# EAGLE design DMX_isolated (EAGLE 6.4)
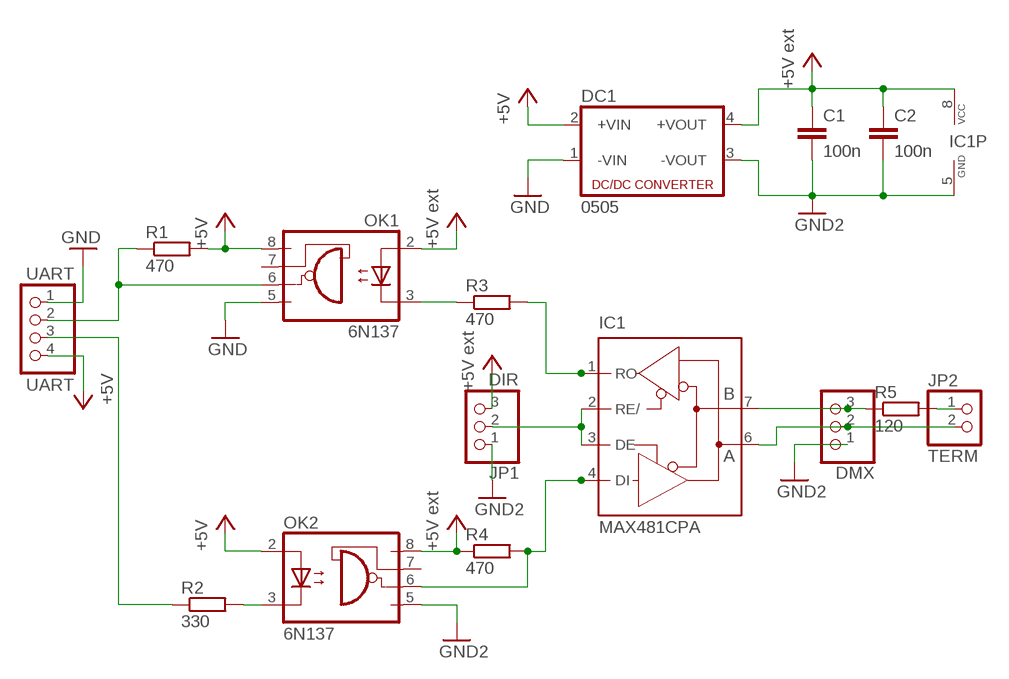
[diagram p0: schematic, sheet 1]

## Parts
C1  100n  C-EU050-024X044  [C050-024X044]
C2  100n  C-EU050-024X044  [C050-024X044]
DC1  0505  NME  [NME]
DMX  PINHD-1X3  [1X03]
IC1  MAX481CPA  [DIL08]
JP1  DIR  PINHD-1X3  [1X03]
JP2  TERM  PINHD-1X2  [1X02]
OK1  6N137  [DIL08]
OK2  6N137  [DIL08]
R1  470  R-EU_0204/5  [0204/5]
R2  330  R-EU_0204/5  [0204/5]
R3  470  R-EU_0204/5  [0204/5]
R4  470  R-EU_0204/2V  [0204V]
R5  120  R-EU_0204/2V  [0204V]
UART  UART  PINHD-1X4  [1X04]

## Nets
+5V: DC1.2(+VIN) OK1.8(VCC) OK2.2(A) R1.2 UART.4
+5V_EXT: C1.1 C2.1 DC1.4(+VOUT) IC1.8(VCC) JP1.3 OK1.2(A) OK2.8(VCC) R4.1 ; supply symbol labelled +5V ext
D2: R2.1 UART.3
GND: DC1.1(-VIN) OK1.5(GND) UART.1
GND_EXT: C1.2 C2.2 DC1.3(-VOUT) DMX.1 IC1.5(GND) JP1.1 OK2.5(GND) ; supply symbol labelled GND2
N$1: JP2.1 R5.2
N$2: DMX.3 IC1.7(B) R5.1
N$5: OK2.3(C) R2.2
N$6: IC1.2(RE/) IC1.3(DE) JP1.2
N$7: IC1.4(DI) OK2.6(VO) R4.2
N$8: OK1.3(C) R3.1
N$9: IC1.1(RO) R3.2
N$10: OK1.6(VO) R1.1 UART.2
N$17: DMX.2 IC1.6(A) JP2.2
Unconnected: OK1.7(VE) OK2.7(VE)

## Library data of the parts
C1 C2 = rcl:C-EU: CAPACITOR, European symbol
DC1 = dc-dc-converter:NME: DC-DC CONVERTER; MF: C & D TECHNOLOGIES, INC; MPN: NME1205D; OC_FARNELL: 1021466; OC_NEWARK: 98B8198
DMX = pinhead:PINHD-1X3: PIN HEADER
IC1 = maxim:MAX481CPA: RS485 TRANSEIVER; MPN: MAX481CPA+; OC_FARNELL: unknown; OC_NEWARK: 99K3445
JP1 = adafruit:PINHD-1X3: PIN HEADER
JP2 = pinhead:PINHD-1X2: PIN HEADER
OK1 OK2 = optocoupler:6N137: MOTOROLA OPTO COUPLER; MPN: 6N137; OC_FARNELL: 1328376; OC_NEWARK: 52M1895
R1-R5 = resistor:R-EU_: RESISTOR, European symbol
UART = pinhead:PINHD-1X4: PIN HEADER

## Net classes
1 power: width 0.508 mm

## Board
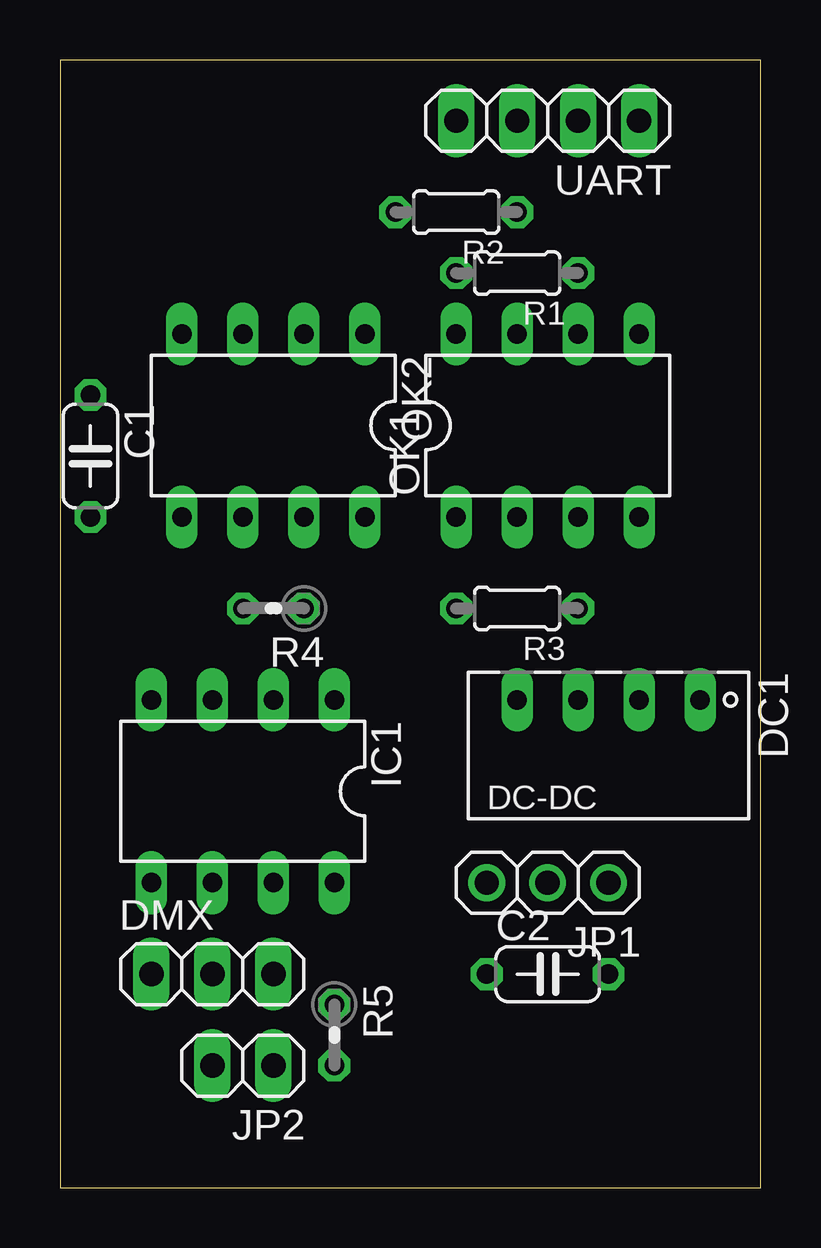
[diagram p1: board, top side]
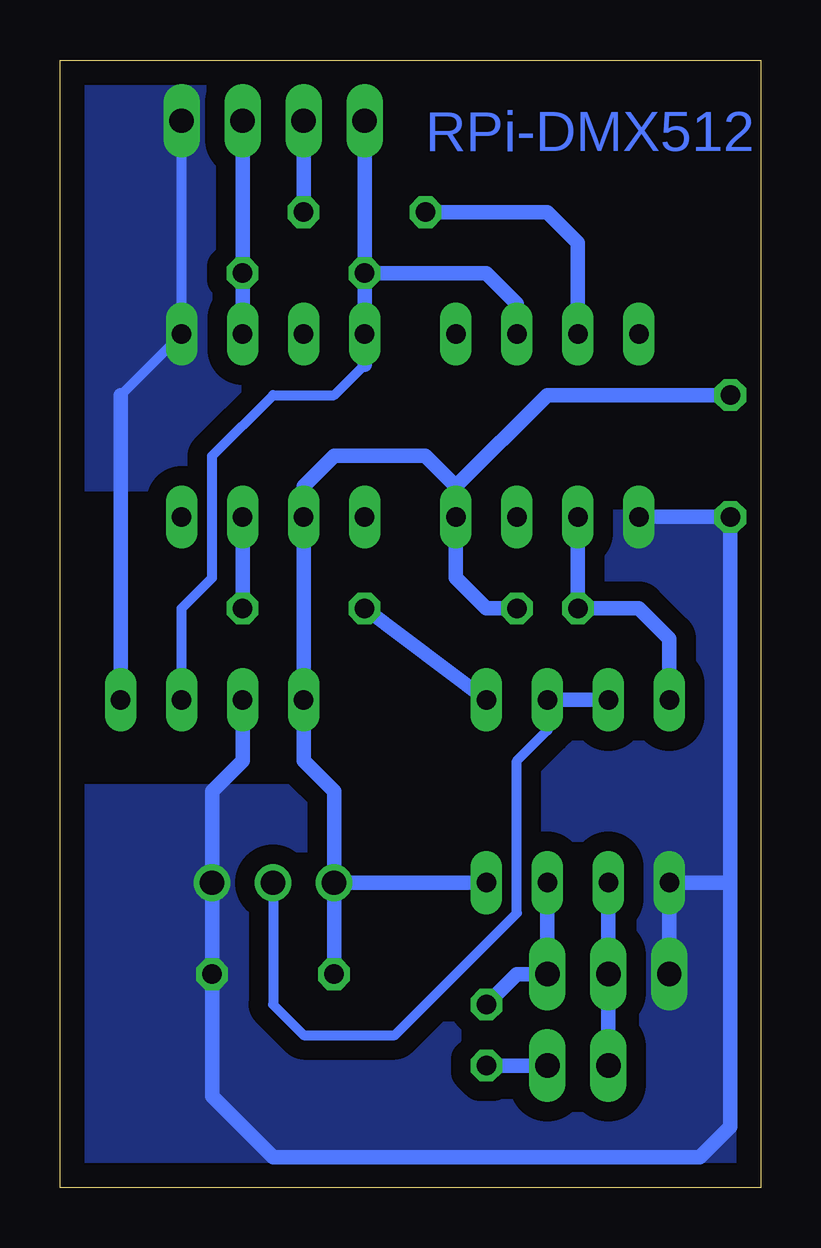
[diagram p2: board, bottom side, seen from below]

Size 29.2 x 46.98 mm. Coordinates in mm from the lower left corner, seen from the top.
Outline: 0,0 29.2,0 29.2,46.98 0,46.98 0,0
Copper layers (1*16): Top 0.035mm / dielectric 1.5mm / Bottom 0.035mm
Design rules "default": minimum track width 10mil, minimum drill 24mil, track to track 8mil, track to pad 8mil, pad to pad 8mil, via to via 8mil, smd to smd 8mil, copper to edge 40mil, drill to drill 8mil, minimum pad ring 10mil, minimum via ring 8mil, stop-mask expansion 4mil, vias tented up to drill 0mil, thermal gap 10mil

### Footprints (pad centres in the part's own frame; a part is rotated, then mirrored left to right if it is on the bottom)
C050-024X044 = drill 0.813 octagon: 1 -2.54,0; 2 2.54,0
NME = drill 0.813 long: 1 0,3.81; 2 0,1.27; 3 0,-1.27; 4 0,-3.81
1X03 = drill 1.016 long: 1 -2.54,0; 2 0,0; 3 2.54,0
DIL08 = drill 0.813 long: 1 -3.81,-3.81; 2 -1.27,-3.81; 3 1.27,-3.81; 4 3.81,-3.81; 5 3.81,3.81; 6 1.27,3.81; 7 -1.27,3.81; 8 -3.81,3.81
1X03' = drill 1.016: 1 -2.54,0; 2 0,0; 3 2.54,0
1X02 = drill 1.016 long: 1 -1.27,0; 2 1.27,0
0204/5 = drill 0.813 octagon: 1 -2.54,0; 2 2.54,0
0204V = drill 0.813 octagon: 1 -1.27,0; 2 1.27,0
1X04 = drill 1.016 long: 1 -3.81,0; 2 -1.27,0; 3 1.27,0; 4 3.81,0

### Placement (x,y rotation side)
C1  1.27,30.48 270 top
C2  20.32,8.89 0 top
DC1  22.86,20.32 270 top
DMX  6.35,8.89 0 top
IC1  7.62,16.51 180 top
JP1  DIR  [1X03']  20.32,12.7 180 top
JP2  7.62,5.08 180 top
OK1  20.32,31.75 0 top
OK2  8.89,31.75 180 top
R1  19.05,38.1 180 top
R2  16.51,40.64 180 top
R3  19.05,24.13 180 top
R4  8.89,24.13 180 top
R5  11.43,6.35 270 top
UART  20.32,44.45 180 top

### Tracks (layer width: path | path; a pad name or v marks a point on that pad's centre or on a via)
+5V
  Bottom 0.406: DC1.2 24.13,24.13 22.86,25.4 22.86,30.48 20.32,33.02 17.78,33.02 16.51,34.29
  Bottom 0.61: UART.4 R1.2 | R1.2 OK1.8 16.51,34.29 | R1.2 11.43,38.1 10.16,36.83 OK2.2
+5V_EXT
  Bottom 0.406: OK2.8 12.7,29.21 | 19.05,29.21 OK1.2 | 17.78,11.43 JP1.3
  Bottom 0.61: C1.1 8.89,33.02 12.7,29.21 13.97,30.48 17.78,30.48 19.05,29.21 | OK1.2 DC1.4 19.05,17.78 17.78,16.51 JP1.3 | C2.1 JP1.3 | IC1.8 JP1.3 | R4.1 11.43,24.13 12.7,25.4 OK2.8
D2
  Bottom 0.61: R2.1 UART.3
GND
  Bottom 0.406: UART.1 OK1.5 26.67,33.02
  Bottom 0.61: DC1.1 26.67,33.02
  pour Bottom (isolate 0.813, no thermals): 0,46.99 29.21,46.99 29.21,29.21 0,29.21
GND_EXT
  Bottom 0.61: OK2.5 C1.2 1.27,12.7 | DMX.1 IC1.5 1.27,12.7 | DC1.3 21.59,17.78 22.86,16.51 JP1.1 C2.2 22.86,3.81 20.32,1.27 2.54,1.27 1.27,2.54 1.27,12.7
  pour Bottom (isolate 0.813, no thermals): 29.21,0 0,0 0,16.51 29.21,16.51
  pour Bottom (isolate 0.813, no thermals): 0,27.94 12.7,27.94 12.7,16.51 0,16.51
N$1
  Bottom 0.61: JP2.1 R5.2
N$2
  Bottom 0.61: IC1.7 DMX.3 10.16,8.89 R5.1
N$5
  Bottom 0.61: OK2.3 7.62,39.37 8.89,40.64 R2.2
N$6
  Bottom 0.406: JP1.2 20.32,7.62 19.05,6.35 15.24,6.35 10.16,11.43 10.16,17.78 8.89,19.05 IC1.2
  Bottom 0.61: IC1.3 IC1.2
N$7
  Bottom 0.61: OK2.6 R4.2 5.08,24.13 3.81,22.86 IC1.4
N$8
  Bottom 0.61: R3.1 OK1.3
N$9
  Bottom 0.61: IC1.1 R3.2
N$10
  Bottom 0.61: UART.2 R1.1 OK1.6
N$17
  Bottom 0.61: IC1.6 DMX.2 JP2.2

### Text on the board
Bottom: RPi-DMX512